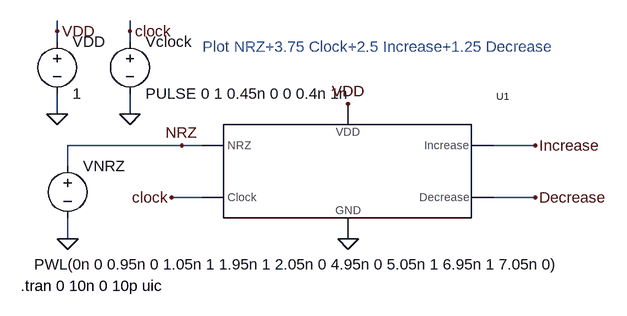
[diagram p0: schematic Fig19_70.asc]
Fig19_70.asc, the LTspice schematic file:
Version 4
SHEET 1 6288 680
WIRE 1168 -1104 1168 -1120
WIRE 1168 -1088 1168 -1104
WIRE 1168 -976 1168 -1008
WIRE 1184 -896 1184 -928
WIRE 1184 -784 1184 -816
WIRE 1280 -1104 1280 -1120
WIRE 1280 -1088 1280 -1104
WIRE 1280 -976 1280 -1008
WIRE 1360 -928 1184 -928
WIRE 1392 -928 1360 -928
WIRE 1392 -848 1344 -848
WIRE 1904 -928 1840 -928
WIRE 1904 -848 1840 -848
FLAG 1168 -976 0
FLAG 1168 -1104 VDD
FLAG 1616 -784 0
FLAG 1616 -992 VDD
FLAG 1344 -848 clock
FLAG 1360 -928 NRZ
FLAG 1904 -928 Increase
FLAG 1904 -848 Decrease
FLAG 1184 -784 0
FLAG 1280 -976 0
FLAG 1280 -1104 clock
SYMBOL voltage 1168 -1104 R0
WINDOW 123 0 0 Left 0
WINDOW 39 0 0 Left 0
SYMATTR InstName VDD
SYMATTR Value 1
SYMBOL voltage 1184 -912 R0
WINDOW 123 0 0 Left 0
WINDOW 39 0 0 Left 0
WINDOW 3 -51 167 Left 0
SYMATTR Value PWL(0n 0 0.95n 0 1.05n 1 1.95n 1 2.05n 0 4.95n 0 5.05n 1 6.95n 1 7.05n 0)
SYMATTR InstName VNRZ
SYMBOL voltage 1280 -1104 R0
WINDOW 123 0 0 Left 0
WINDOW 39 0 0 Left 0
SYMATTR InstName Vclock
SYMATTR Value PULSE 0 1 0.45n 0 0 0.4n 1n
SYMBOL Hogge_PD_nodelay 1424 -880 R0
SYMATTR InstName U1
TEXT 1112 -712 Left 0 !.tran 0 10n 0 10p uic
TEXT 1392 -1080 Left 0 ;Plot NRZ+3.75 Clock+2.5 Increase+1.25 Decrease

The netlist it stands for:
* Fig19_70.asc
VDD VDD 0 1
VNRZ NRZ 0 PWL(0n 0 0.95n 0 1.05n 1 1.95n 1 2.05n 0 4.95n 0 5.05n 1 6.95n 1 7.05n 0)
Vclock clock 0 PULSE 0 1 0.45n 0 0 0.4n 1n
XU1 NRZ clock Increase Decrease VDD 0 Hogge_PD_nodelay  ; pins NRZ Clock Increase Decrease VDD GND
.tran 0 10n 0 10p uic
* Plot NRZ+3.75 Clock+2.5 Increase+1.25 Decrease
.backanno
.end